# Altium schematic sheet USBIface.SchDoc
size A; SheetNumber: 7; SheetTotal: 9
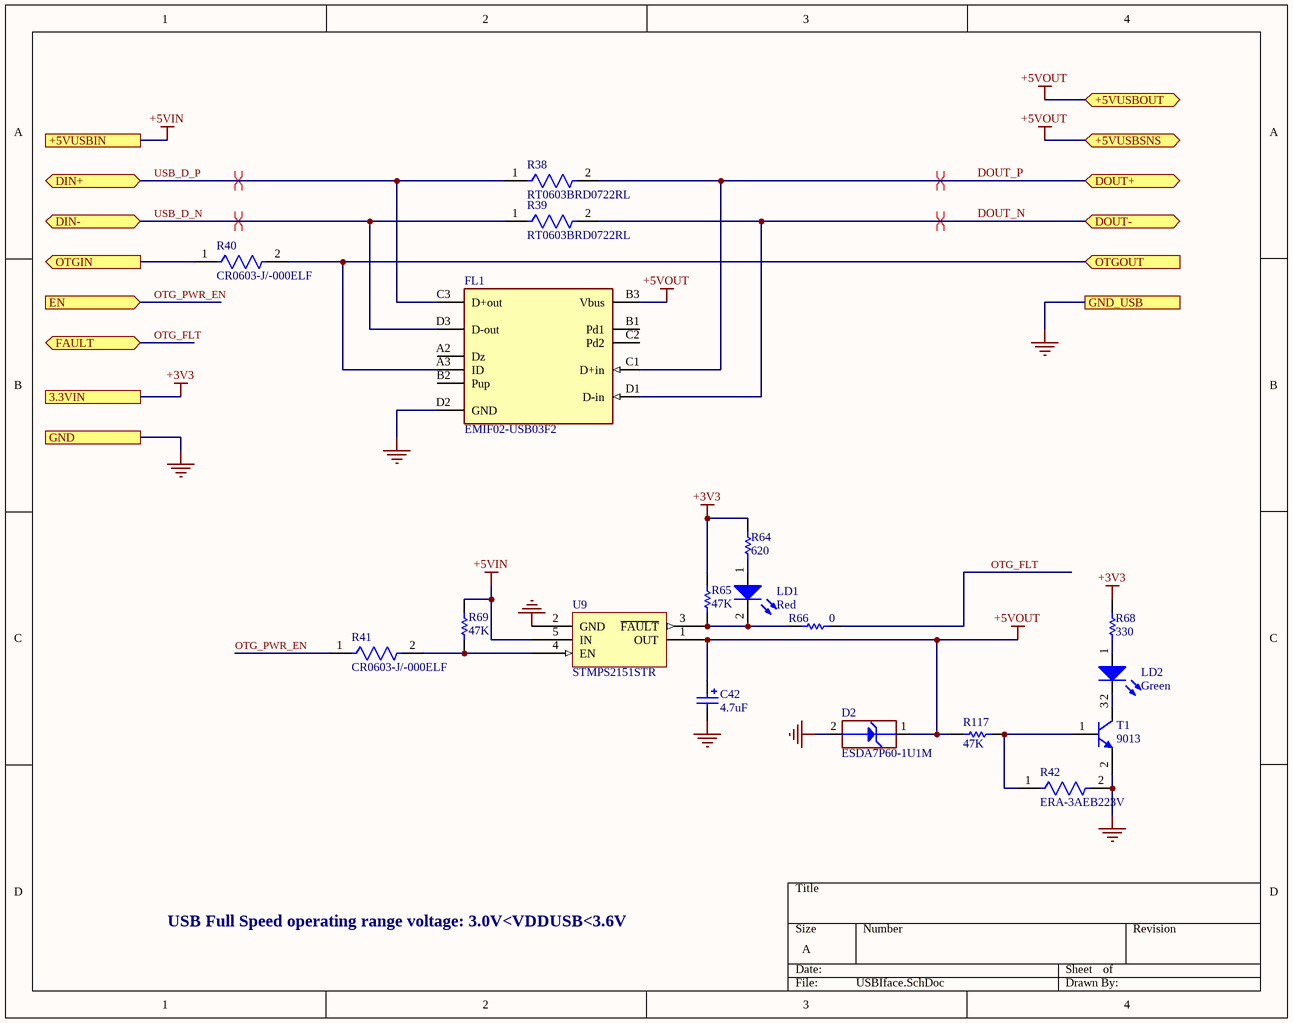
[diagram p0: USBIface.SchDoc]

## Parts
C42  4.7uF  [TAN-A]
D2  ESDA7P60-1U1M  [DO_2SM_1R6X1_21]
FL1  EMIF02-USB03F2  [FP-EMIF02-USB03F2-MFG]
LD1  Red  [0603D]
LD2  Green  [0603D]
R38  RT0603BRD0722RL  [FP-RT0603-MFG]
R39  RT0603BRD0722RL  [FP-RT0603-MFG]
R40  CR0603-J/-000ELF  [FP-CR0603-MFG]
R41  CR0603-J/-000ELF  [FP-CR0603-MFG]
R42  ERA-3AEB223V  [FP-ERA3A-MFG]
R64  620  [0603R]
R65  47K  [0603R]
R66  0  [0603R]
R68  330  [0603R]
R69  47K  [0603R]
R117  47K  [0603R]
T1  9013  [SOT-23]
U9  STMPS2151STR  [SOT23-5N]

## Ports
3.3VIN, +5VUSBIN, +5VUSBOUT (bidir), +5VUSBSNS (bidir), DIN+ (bidir), DIN- (bidir), DOUT+ (bidir), DOUT- (bidir), EN (in), FAULT (bidir), GND, GND_USB, OTGIN (out), OTGOUT (in)

## Nets
+3V3: R64.2 R65.1 R68.2 ; port 3.3VIN
+5VIN: R69.2 U9.5(IN) ; port +5VUSBIN
+5VOUT: C42.1 D2.1(IO1) FL1.B3(Vbus) R117.1 U9.1(OUT) ; port +5VUSBOUT, port +5VUSBSNS
GND: C42.2 D2.2(GND) FL1.D2(GND) R42.2 T1.2(E) U9.2(GND) ; port GND, port GND_USB
DOUT_N: FL1.D1(D-in) R39.2 ; port DOUT-
DOUT_P: FL1.C1(D+in) R38.2 ; port DOUT+
OTG_FLT: R66.1 ; port FAULT
OTG_PWR_EN: R41.1 ; port EN
OTGIN: R40.1 ; port OTGIN
OTGOUT: FL1.A3(ID) R40.2 ; port OTGOUT
USB_D_N: FL1.D3(D-out) R39.1 ; port DIN-
USB_D_P: FL1.C3(D+out) R38.1 ; port DIN+
NetLD1_1: LD1.1(A) R64.1
NetLD1_2: LD1.2(K) R65.2 R66.2 U9.3(~{FAULT})
NetLD2_1: LD2.1(A) R68.1
NetLD2_2: LD2.2(K) T1.3(C)
NetR41_2: R41.2 R69.1 U9.4(EN)
NetR42_1: R42.1 R117.2 T1.1(B)

Not connected (* = marked no-connect by the designer): FL1 A2(Dz) B1(Pd1) B2(Pup) C2(Pd2)

## Layout directives
differential pair: DOUT_N, DOUT_P, USB_D_N, USB_D_P

## Notes on the sheet
- USB Full Speed operating range voltage: 3.0V<VDDUSB<3.6V

## Library data of the parts
C42 = Cap Pol1: Polarized Capacitor (Radial); Value: 47uF; Published: 8-Jun-2000; Revision: July-2002: Re-released for DXP Platform.; Publisher: Altium Limited
D2 = MCD-00251: High power transient voltage suppressor, 7V breakdown; Manuf_1: STM; ECCN_US/EU: EAR99/NEC; Fitted: YES; Manuf_Part_1: ESDA7P60-1U1M; Ordered by: STM; Value: ESDA7P60-1U1M; Internal_Part_Number: MCD-00251; PartType: ICS; Manufacturer_Part_Number_1: ESDA7P60-1U1M; Manufacturer_1: STM; ComponentLink1URL: ST_ESDA7P60-1U1M.pdf; Provided_By: STM
FL1 = CMP-12082-000002-1: FILTER RC(PI) 33 OHM/20PF SMD; DC Resistance (DCR): 2R; ESD Protection: Yes; Number of Channels: 2; Tolerance: 5%; Series: EMIF; RoHS Compliant: Yes; Package Quantity: 5000; REACH SVHC: No SVHC; Termination: Flat; Width: 0.057inch; Length: 1.94mm; Min Operating Temperature: -40°C; Max Operating Temperature: 85°C; Lead Free: Lead Free; Depth: 1.57mm; Number of Pins: 11; Mount: Surface Mount; Height: 0.028inch; Packaging: Tape and Reel; Case/Package: FCBGA; Radiation Hardening: No
LD1 LD2 = LED2: Typical RED, GREEN, YELLOW, AMBER GaAs LED; Published: 8-Jun-2000; Revision: July-2002: Re-released for DXP Platform.; Publisher: Altium Limited
R38 R39 = CMP-03412-001872-1: RES SMD 22 OHM 0.1% 1/10W 0603; Manufacturer: Yageo; Resistance: 22Ω; Power Rating: 0.1W; Temperature Coefficient: 25 ppm/°C; Voltage Rating: 75V; Tolerance: 0.001; Value: 22Ω; Category: Res; Lead Free: Yes; Composition: Thin Film; ComponentLink2Description: Datasheet; Series: RT; Ipc Land Pattern Name: RESC16080X45; RoHS: TRUE; Manufacturer Part Number: RT0603BRD0722RL; Digikey Description: RES SMD 22 OHM 0.1% 1/10W 0603; Temperature: -55°C to +155°C; Temperature Range Low: -55°C; Device Class L3: Chip SMD Resistors; Package: RT0603; ComponentLink2URL: http://www.yageo.com/documents/recent/PYu-RT_1-to-0.01_RoHS_L_9.pdf; Automotive: No; Device Class L1: Passive Components; Octopart: https://octopart.com/rt0603brd0722rl-yageo-1422899; Device Class L2: Resistors; Mouser Description: Res SMD 22 Ohm 0.1% 1/10W 0603; Temperature Range High: +155°C; Footprint Url: http://www.yageo.com/exep/pages/download/literatures/PYu-R_Mount_10.pdf; Height: 0.55mm
R40 R41 = CMP-07231-000023-1: Thick Film Chip Resistors 0603 0Ω 0.1W 5%; Power Rating: 100mW; Resistance: 0mR; Voltage Rating (DC): 50V; Tolerance: 1%; Temperature Coefficient: 500ppm/°C; Depth: 0.8mm; Height: 0.45mm; Case Code (Metric): 1608; Number of Pins: 2; Max Operating Temperature: 155°C; Mount: Surface Mount; REACH SVHC: No SVHC; Radiation Hardening: No; Width: 0.8mm; Max Power Dissipation: 100mW; Thickness: 457um; Package Quantity: 5000; Composition: Thick Film; Case/Package: 0603; Military Standard: Not; Packaging: Tape and Reel; Voltage Rating: 50V; Case Code (Imperial): 0603; Min Operating Temperature: -55°C; Contact Plating: Tin; Length: 1.6mm; Termination: SMD/SMT
R42 = CMP-2000-00956-2: RES SMD 22K OHM 0.1% 1/10W 0603; Resistance: 22kR; Temperature Coefficient: 25ppm/°C; Voltage Rating (DC): 75V; Max Power Dissipation: 100mW; Mount: Surface Mount; Length: 1.6mm; Height: 0.45mm; Case/Package: 0603; Depth: 0.8mm; Number of Pins: 2; Width: 0.8mm; Resistance Tolerance: 0.1%; Construction: Rectangular; RoHS Compliant: Yes; Tolerance: 0.1%; Case Code (Metric): 1608; Power Rating: 100mW; Number of Terminations: 2; REACH SVHC: No SVHC; Radiation Hardening: No; Max Operating Temperature: 155°C; Lead Free: Lead Free; Resistor Type: Thin Film; Technology: THIN FILM; Termination: Solder; Packaging: Tape and Reel; Min Operating Temperature: -55°C; Contact Plating: Tin; Voltage Rating: 75V; Military Standard: Not; Series: ERA-3A; Package Quantity: 1; Size Code: 0603; Case Code (Imperial): 0603; Features: Automotive AEC-Q200
R64 R66 R69 = Res1: Resistor; Value: 1K; Published: 8-Jun-2000; Revision: July-2002: Re-released for DXP Platform.; Publisher: Altium Limited
R65 R68 R117 = res1: Resistor; Value: 1K; Published: 8-Jun-2000; Revision: July-2002: Re-released for DXP Platform.; Publisher: Altium Limited
T1 = NPN: NPN Bipolar Transistor; Code - JEDEC: TO-226-AA; Published: 8-Jun-2000; Revision: July-2002: Re-released for DXP Platform.; Publisher: Altium Limited
U9 = STMPS2141STR: Ordered by: STM